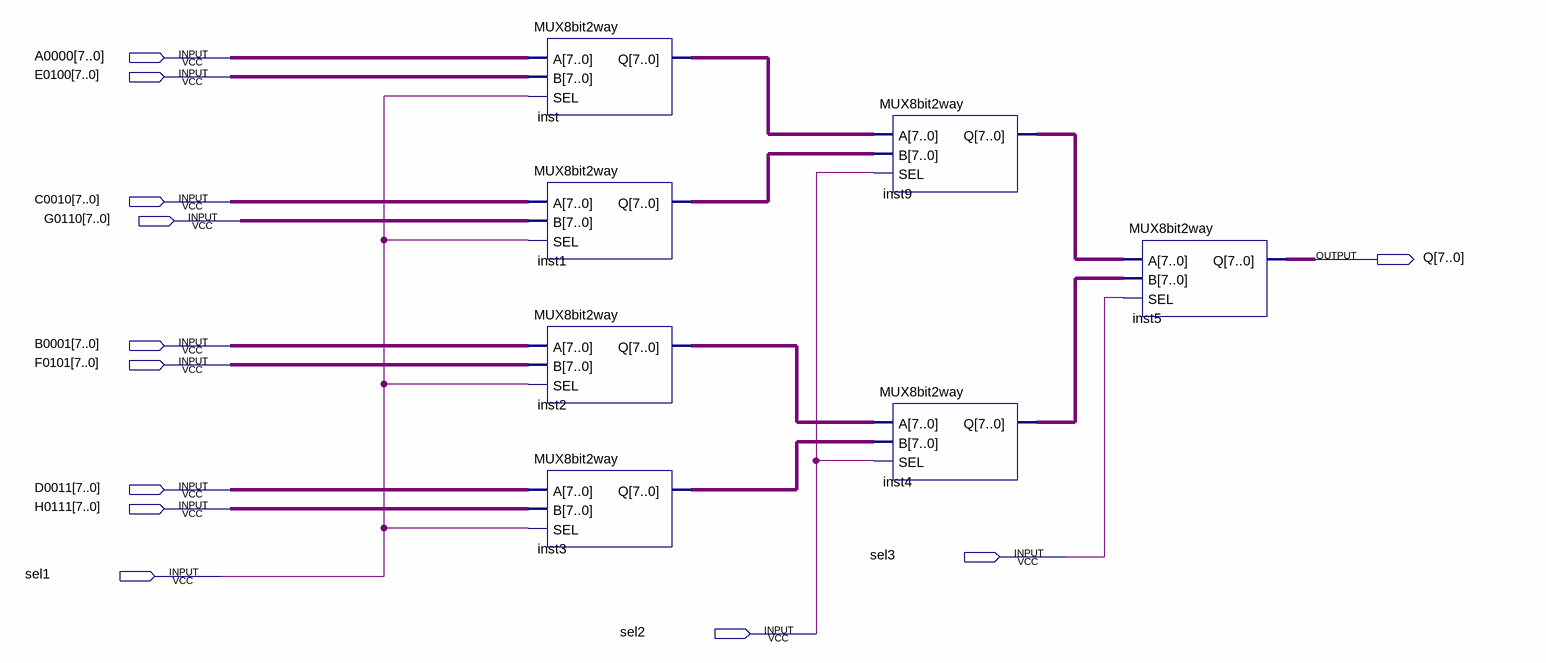
[diagram p0: schematic sheet]
// Quartus schematic MUX8bit4way.bdf as structural Verilog: 7 symbols, 12 pins
module MUX8bit4way (
  input  [7:0] A0000,
  input  [7:0] E0100,
  input  [7:0] C0010,
  input  [7:0] G0110,
  input  [7:0] B0001,
  input  [7:0] F0101,
  input  [7:0] D0011,
  input  [7:0] H0111,
  input  sel3,
  input  sel1,
  input  sel2,
  output [7:0] Q
);

  wire [7:0] inst1_q, inst2_q, inst3_q, inst4_q, inst9_q, inst_q;

  MUX8bit2way inst (.A(A0000), .B(E0100), .SEL(sel1), .Q(inst_q));
  MUX8bit2way inst1 (.A(C0010), .B(G0110), .SEL(sel1), .Q(inst1_q));
  MUX8bit2way inst2 (.A(B0001), .B(F0101), .SEL(sel1), .Q(inst2_q));
  MUX8bit2way inst3 (.A(D0011), .B(H0111), .SEL(sel1), .Q(inst3_q));
  MUX8bit2way inst9 (.A(inst_q), .B(inst1_q), .SEL(sel2), .Q(inst9_q));
  MUX8bit2way inst4 (.A(inst2_q), .B(inst3_q), .SEL(sel2), .Q(inst4_q));
  MUX8bit2way inst5 (.A(inst9_q), .B(inst4_q), .SEL(sel3), .Q(Q));
endmodule
